# Altium schematic sheet TI_POW.SchDoc
size A0
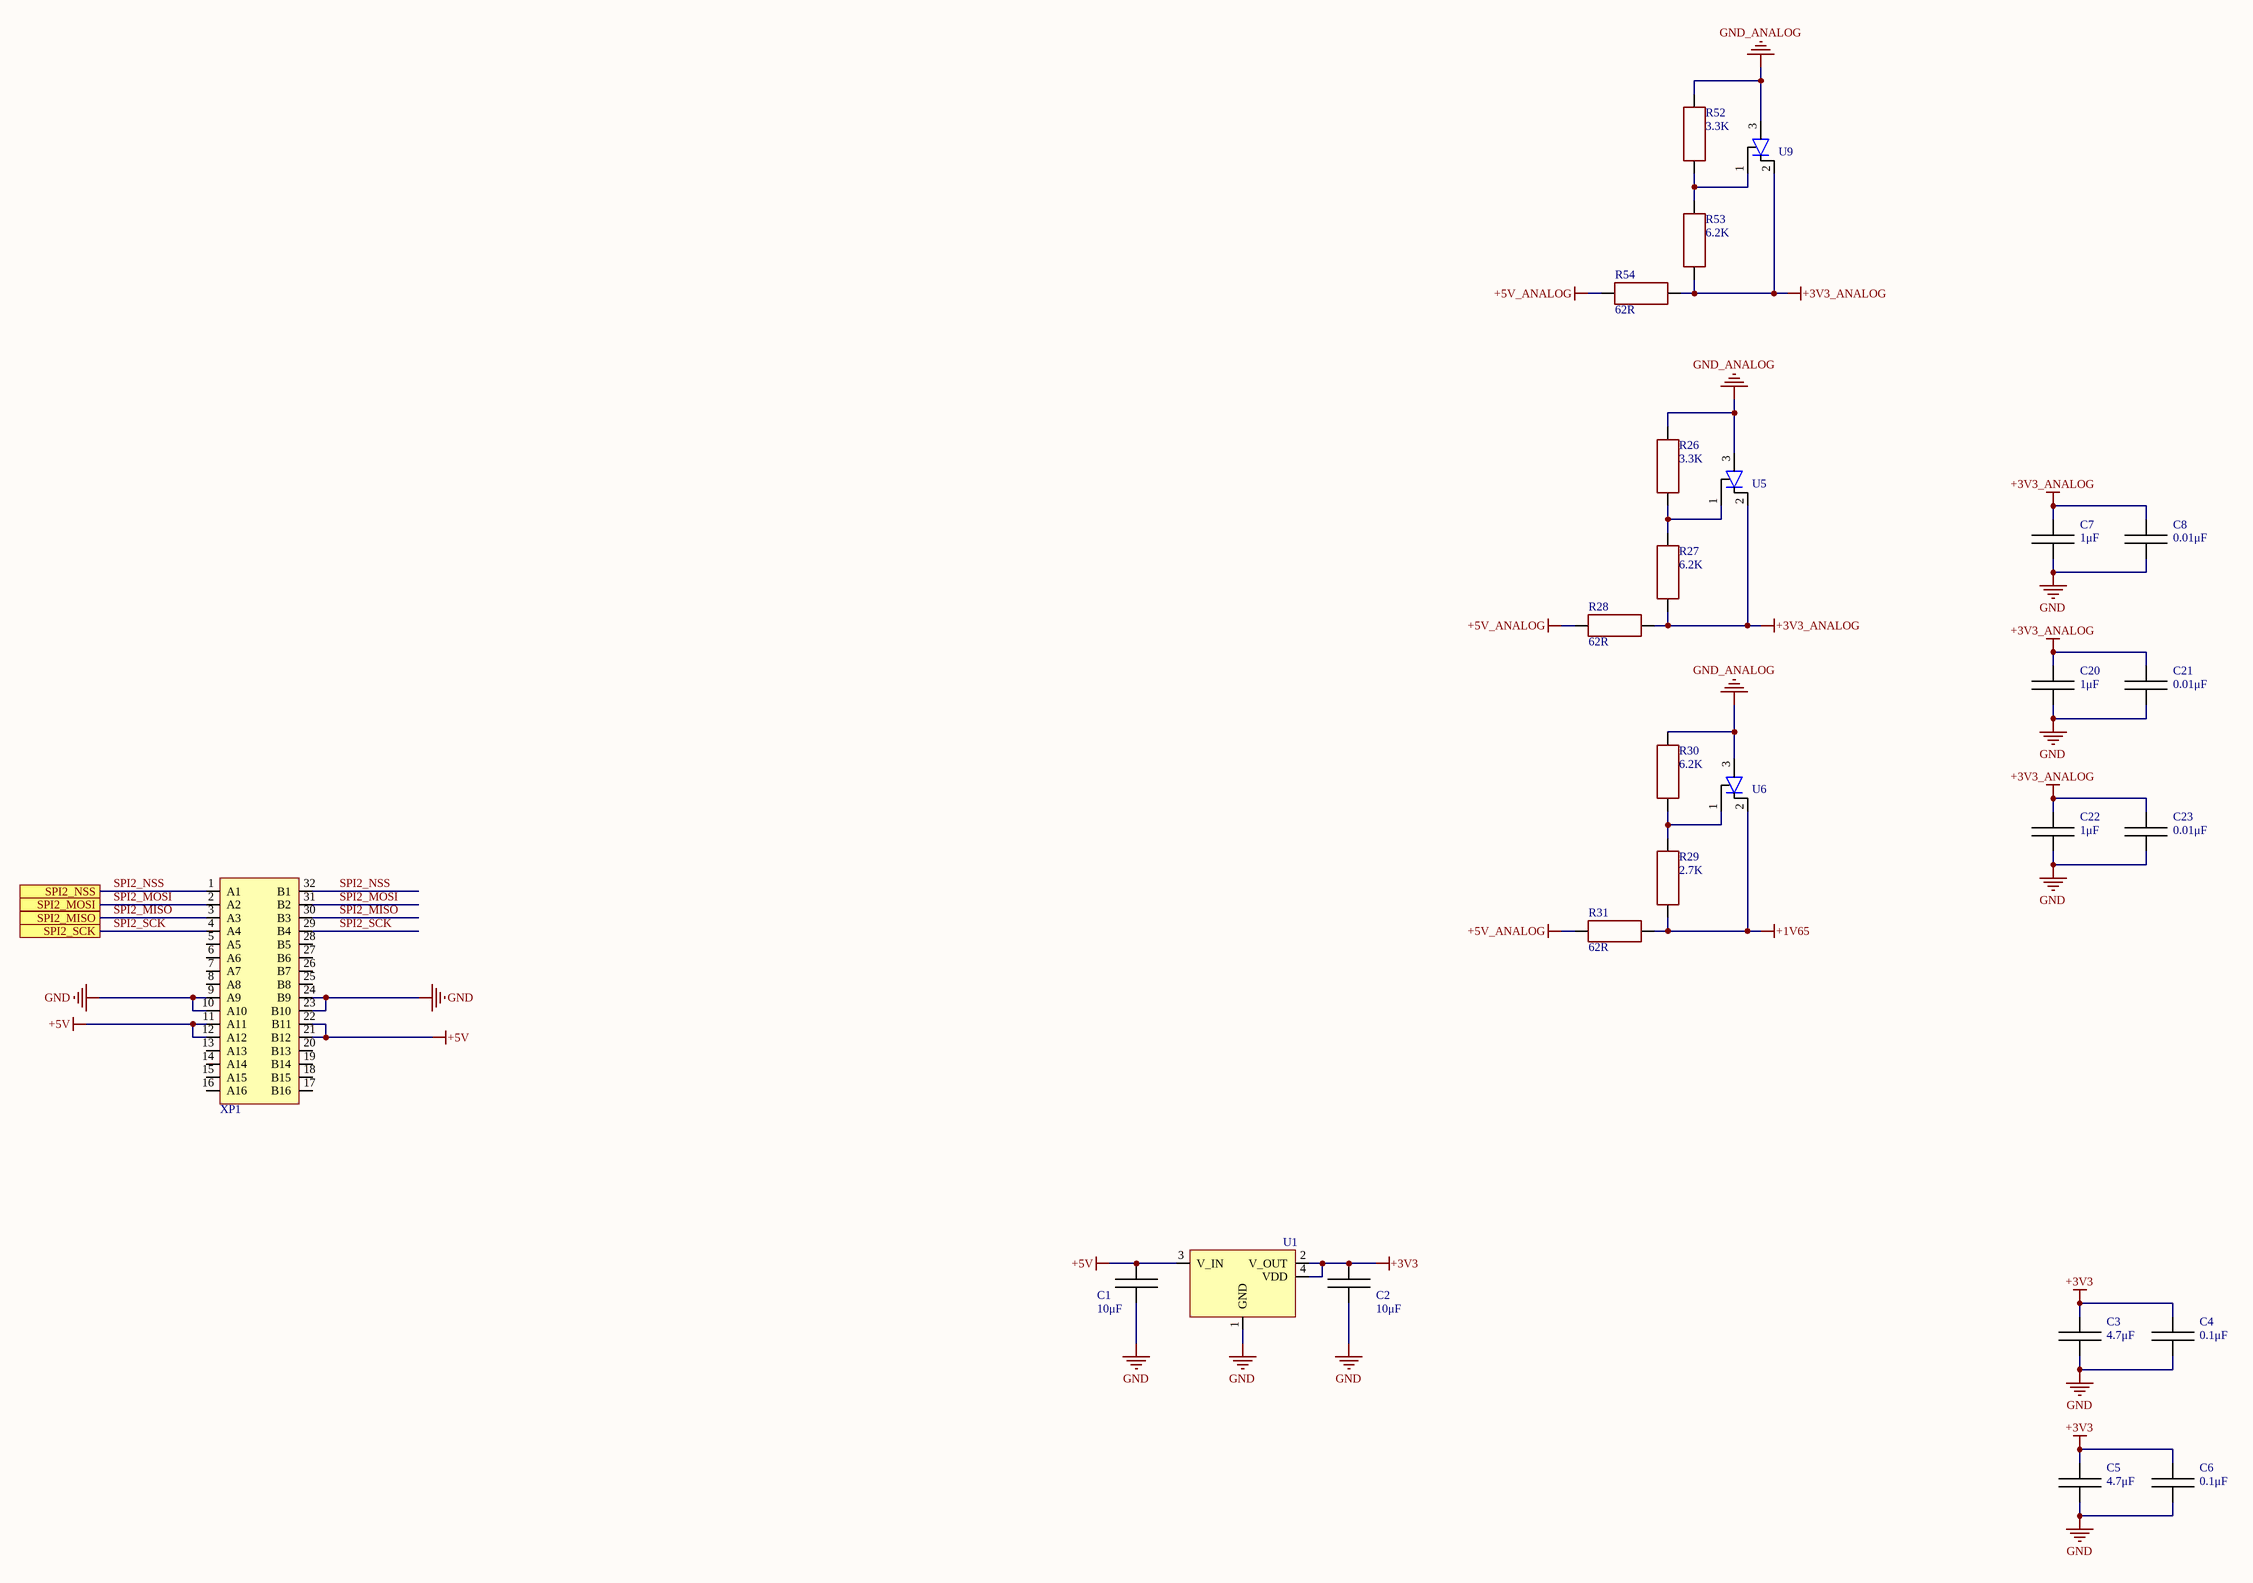
[diagram p0: TI_POW.SchDoc]

## Parts
C1  value 10μF  [CAP: 2220]  (hidden comment: Cap_2220)
C2  value 10μF  [CAP: 2220]  (hidden comment: Cap_2220)
C3  value 4.7μF  [CAP: 0603]  (hidden comment: Cap_0603)
C4  value 0.1μF  [CAP: 0603]  (hidden comment: Cap_0603)
C5  value 4.7μF  [CAP: 0603]  (hidden comment: Cap_0603)
C6  value 0.1μF  [CAP: 0603]  (hidden comment: Cap_0603)
C7  value 1μF  [CAP: 0603]  (hidden comment: Cap_0603)
C8  value 0.01μF  [CAP: 0603]  (hidden comment: Cap_0603)
C20  value 1μF  [CAP: 0603]  (hidden comment: Cap_0603)
C21  value 0.01μF  [CAP: 0603]  (hidden comment: Cap_0603)
C22  value 1μF  [CAP: 0603]  (hidden comment: Cap_0603)
C23  value 0.01μF  [CAP: 0603]  (hidden comment: Cap_0603)
R26  value 3.3K  [RES: 0603]  (hidden comment: Resistor_0603)
R27  value 6.2K  [RES: 0603]  (hidden comment: Resistor_0603)
R28  value 62R  [RES: 0603]  (hidden comment: Resistor_0603)
R29  value 2.7K  [RES: 0603]  (hidden comment: Resistor_0603)
R30  value 6.2K  [RES: 0603]  (hidden comment: Resistor_0603)
R31  value 62R  [RES: 0603]  (hidden comment: Resistor_0603)
R52  value 3.3K  [RES: 0603]  (hidden comment: Resistor_0603)
R53  value 6.2K  [RES: 0603]  (hidden comment: Resistor_0603)
R54  value 62R  [RES: 0603]  (hidden comment: Resistor_0603)
U1  LD1117S33CTR4  [SOT-223-3]  (value not drawn)
U5  TLVH431BIL3T  [SOT-23-3]  (value not drawn)
U6  TLVH431BIL3T  [SOT-23-3]  (value not drawn)
U9  TLVH431BIL3T  [SOT-23-3]  (value not drawn)
XP1  DS1118-32M-R23  [DS1118-32M-R23]  (value not drawn)

## Ports
SPI2_MISO, SPI2_MOSI, SPI2_NSS, SPI2_SCK

## Nets
+1V65: R29.1 R31.1 U6.2
+3V3: C2.2 C3.2 C4.2 C5.2 C6.2 U1.2(V_OUT) U1.4(VDD)
+3V3_ANALOG: C7.2 C8.2 C20.2 C21.2 C22.2 C23.2 R27.1 R28.1 R53.1 R54.1 U5.2 U9.2
+5V: C1.2 U1.3(V_IN) XP1.11(A11) XP1.12(A12) XP1.21(B12) XP1.22(B11)
+5V_ANALOG: R28.2 R31.2 R54.2
GND: C1.1 C2.1 C3.1 C4.1 C5.1 C6.1 C7.1 C8.1 C20.1 C21.1 C22.1 C23.1 U1.1(GND) XP1.9(A9) XP1.10(A10) XP1.23(B10) XP1.24(B9)
GND_ANALOG: R26.2 R30.2 R52.2 U5.3 U6.3 U9.3
SPI2_MISO: XP1.3(A3) XP1.30(B3) ; port SPI2_MISO
SPI2_MOSI: XP1.2(A2) XP1.31(B2) ; port SPI2_MOSI
SPI2_NSS: XP1.1(A1) XP1.32(B1) ; port SPI2_NSS
SPI2_SCK: XP1.4(A4) XP1.29(B4) ; port SPI2_SCK
NetR26_1: R26.1 R27.2 U5.1
NetR29_2: R29.2 R30.1 U6.1
NetR52_1: R52.1 R53.2 U9.1

Not connected (* = marked no-connect by the designer): XP1 5(A5) 6(A6) 7(A7) 8(A8) 13(A13) 14(A14) 15(A15) 16(A16) 17(B16) 18(B15) 19(B14) 20(B13) 25(B8) 26(B7) 27(B6) 28(B5)

## Library data of the parts
C1 C2 = Cap_2220: TypeDielectric: X7R(X5R); Voltage: 16V; Package/Case: 2220; Temperature: -55...+125°C(-55...+85°C); Product Category: Capacitors
C3 C5 = Cap_0603: TypeDielectric: X7R(X5R); Voltage: 25V; Package/Case: 0603; Temperature: -55...+125°C(-55...+85°C); Product Category: Capacitors
C4 C6 C7 C20 C22 = Cap_0603: TypeDielectric: X7R(X5R); Voltage: 16V; Package/Case: 0603; Temperature: -55...+125°C(-55...+85°C); Product Category: Capacitors
C8 C21 C23 = Cap_0603: TypeDielectric: X7R(X5R); Voltage: 50V; Package/Case: 0603; Temperature: -55...+125°C(-55...+85°C); Product Category: Capacitors
R26-R31 R52-R54 = Resistor_0603: Power: 0.1W; Tolerance: ±5%; Package/Case: 0603; Temperature: -55...+125°C; Product Category: Resistors
U1 = LD1117S33CTR: LDO Voltage Regulator 3.3V 0.8A Positive; Manufacturer: STMicroelectronics; Datasheet: https://eu.mouser.com/datasheet/2/389/cd00000544-1795431.pdf; HelpURL: https://eu.mouser.com/ProductDetail/STMicroelectronics/LD1117S33CTR?qs=8u%2FLf1IQwKF9meFZLHfRog%3D%3D; Package/Case: SOT-223-3; Product Category: Voltage Regulators
U5 U6 U9 = TLVH431BIL3T: Voltage References 1.24V to 18V Prog Shunt Ref 100uA 60mA; Manufacturer: STMicroelectronics; Datasheet: https://eu.mouser.com/datasheet/2/389/dm00057412-1797844.pdf; HelpURL: https://eu.mouser.com/ProductDetail/STMicroelectronics/TLVH431BIL3T?qs=NC%2FuX8ipg1S4rbg4USQCPA%3D%3D; Package/Case: SOT-23; Product Category: Voltage References
XP1 = DS1118-32M-R23: DIN 41612 Connector; Manufacturer: Connfly; Analogue: HARTING 09221326951(https://eu.mouser.com/ProductDetail/HARTING/09221326951?qs=Afqhj6cPmO9f0oVZo6yWiA%3D%3D); Datasheet: http://en.connfly.group/static/upload/file/pdf/DS1118.pdf; HelpURL: https://www.chipdip.by/product/din41612r-ds1118-32m-r23; Product Category: Connectors